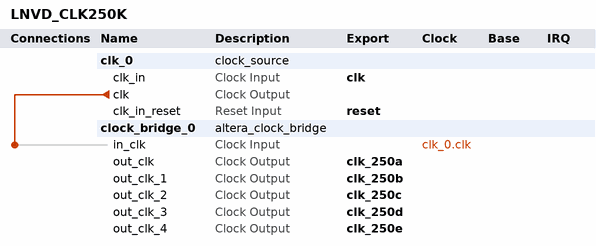
[diagram p0: system contents]
# Platform Designer (Qsys) system LNVD_CLK250K, MAX 10 10M50DAF484C6GES
# Parameters at their usual value, and those the tool derives, are not listed.
package require -exact qsys 22.1
create_system LNVD_CLK250K
set_project_property DEVICE_FAMILY {MAX 10}
set_project_property DEVICE 10M50DAF484C6GES

add_instance clk_0 clock_source 22.1
set_instance_parameter_value clk_0 clockFrequency 50000000

add_instance clock_bridge_0 altera_clock_bridge 22.1
set_instance_parameter_value clock_bridge_0 DERIVED_CLOCK_RATE 50000000
set_instance_parameter_value clock_bridge_0 EXPLICIT_CLOCK_RATE 1
set_instance_parameter_value clock_bridge_0 NUM_CLOCK_OUTPUTS 5

# connections
add_connection clk_0.clk clock_bridge_0.in_clk clock

# exported interfaces
add_interface clk clock sink
set_interface_property clk EXPORT_OF clk_0.clk_in
add_interface clk_250a clock source
set_interface_property clk_250a EXPORT_OF clock_bridge_0.out_clk
add_interface clk_250b clock source
set_interface_property clk_250b EXPORT_OF clock_bridge_0.out_clk_1
add_interface clk_250c clock source
set_interface_property clk_250c EXPORT_OF clock_bridge_0.out_clk_2
add_interface clk_250d clock source
set_interface_property clk_250d EXPORT_OF clock_bridge_0.out_clk_3
add_interface clk_250e clock source
set_interface_property clk_250e EXPORT_OF clock_bridge_0.out_clk_4
add_interface reset reset sink
set_interface_property reset EXPORT_OF clk_0.clk_in_reset

set_interconnect_requirement {$system} qsys_mm.clockCrossingAdapter HANDSHAKE
set_interconnect_requirement {$system} qsys_mm.enableEccProtection FALSE
set_interconnect_requirement {$system} qsys_mm.insertDefaultSlave FALSE
set_interconnect_requirement {$system} qsys_mm.maxAdditionalLatency 1

save_system LNVD_CLK250K.qsys
